# EAGLE design schematic (EAGLE 6.4)
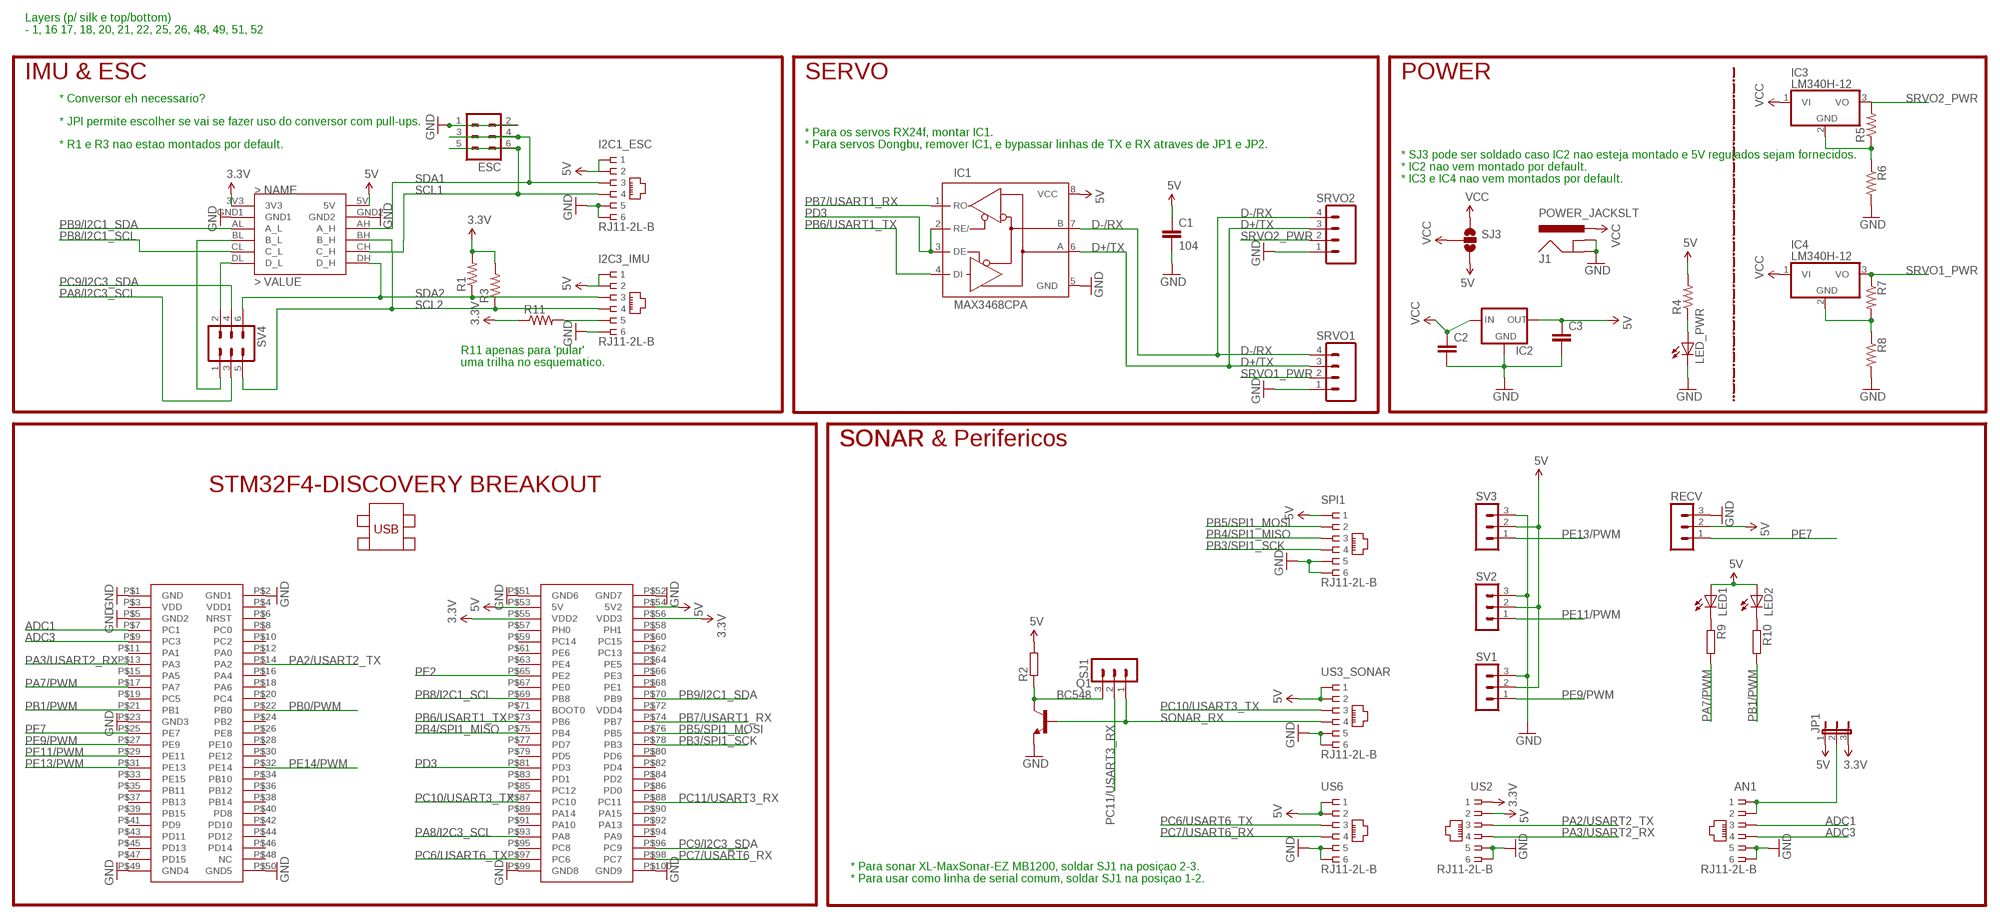
[diagram p0: schematic, sheet 1]

## Parts
AN1  RJ11-2L-B  [RJ11-NO_SHIELD]
C1  104  0.1UF-50V-20%(PTH)KIT-EZ  [CAP-PTH-SMALL-KIT]
C2  C7.5/3  [C7.5B3]
C3  0.1UF-50V-20%(PTH)KIT-EZ  [CAP-PTH-SMALL-KIT]
ESC  MA03-2  [MA03-2]
I2C1_ESC  RJ11-2L-B  [RJ11-NO_SHIELD]
I2C3_IMU  RJ11-2L-B  [RJ11-NO_SHIELD]
IC1  MAX3468CPA  [DIL08]
IC2  V_REG_78XX-TO-220  [TO-220-ALT]
IC3  LM340H-12  [TO220H]
IC4  LM340H-12  [TO220H]
J1  POWER_JACKSLT  [POWER_JACK_SLOT]
JP1  JP2E  [JP2]
LED1  LED3MM  [LED3MM]
LED2  LED3MM  [LED3MM]
LED_PWR  LED5MM  [LED5MM]
Q1  BC548  [TO92-EBC]
R1  R-US_0204/5  [0204/5]
R2  R-EU_0204/7  [0204/7]
R3  R-US_0204/5  [0204/5]
R4  R-US_0204/7  [0204/7]
R5  R-US_0204/7  [0204/7]
R6  R-US_0204/7  [0204/7]
R7  R-US_0204/7  [0204/7]
R8  R-US_0204/7  [0204/7]
R9  R-EU_0204/2V  [0204V]
R10  R-EU_0204/2V  [0204V]
R11  R-US_M1406  [M1406]
RECV  MA03-1  [MA03-1]
SJ1  MA03-1  [MA03-1]
SJ3  SOLDERJUMPER_2WAY-OLDW  [SJ_2W]
SPI1  RJ11-2L-B  [RJ11-NO_SHIELD]
SRVO1  M04POLAR  [MOLEX-1X4]
SRVO2  M04POLAR  [MOLEX-1X4]
SV1  MA03-1  [MA03-1]
SV2  MA03-1  [MA03-1]
SV3  MA03-1  [MA03-1]
SV4  MA03-2  [MA03-2]
U$1  STM32F4-DISCOVERY  [STM32F4-DISCOVERY]
U$2  JYMCU_LOGIC_LEVEL_CONVERTER  [JYMCU_LOGIC_LEVEL_SHIFTER_DIP]
US2  RJ11-2L-B  [RJ11-NO_SHIELD]
US3_SONAR  RJ11-2L-B  [RJ11-NO_SHIELD]
US6  RJ11-2L-B  [RJ11-NO_SHIELD]

## Nets
3.3V: JP1.3 R1.2 R3.2 R11.1 U$1.P$55(VDD2) U$1.P$56(VDD3) U$2.3V3 US2.1
5V: C1.1 C3.1 I2C1_ESC.1 I2C1_ESC.2 I2C3_IMU.1 I2C3_IMU.2 IC1.8(VCC) IC2.OUT JP1.1 LED1.A LED2.A R2.2 R4.2 RECV.2 SJ3.3 SPI1.1 SV1.2 SV2.2 SV3.2 U$1.P$53(5V) U$1.P$54(5V2) U$2.5V US2.2 US3_SONAR.1 US3_SONAR.2 US6.1 US6.2
ADC1: AN1.3 U$1.P$7(PC1)
ADC3: AN1.4 U$1.P$9(PC3)
D+/TX: IC1.6(A) SRVO1.3 SRVO2.3
D-/RX: IC1.7(B) SRVO1.4 SRVO2.4
GND: AN1.5 AN1.6 C1.2 C2.2 C3.2 ESC.1 ESC.2 I2C1_ESC.5 I2C1_ESC.6 I2C3_IMU.6 IC1.5(GND) IC2.GND J1.GND@1(GNDBREAK) J1.GND@2(GND) LED_PWR.K(C) Q1.E R6.2 R8.2 RECV.3 SPI1.5 SPI1.6 SRVO1.1 SRVO2.1 SV1.3 SV2.3 SV3.3 U$1.P$1(GND) U$1.P$2(GND1) U$1.P$5(GND2) U$1.P$23(GND3) U$1.P$49(GND4) U$1.P$50(GND5) U$1.P$51(GND6) U$1.P$52(GND7) U$1.P$99(GND8) U$1.P$100(GND9) U$2.GND1 U$2.GND2 US2.5 US2.6 US3_SONAR.5 US3_SONAR.6 US6.5 US6.6
N$1: SV4.2 U$2.DL(D_L)
N$2: SV4.1 U$2.BL(B_L)
N$3: Q1.C R2.1 SJ1.3
N$4: LED_PWR.A R4.1
N$5: LED1.K(C) R9.1
N$6: IC3.2(GND) R5.1 R6.1
N$7: LED2.K(C) R10.1
N$8: IC4.2(GND) R7.2 R8.1
N$9: I2C3_IMU.5 R11.2
N$10: AN1.1 AN1.2 JP1.2
PA2/USART2_TX: U$1.P$14(PA2) US2.3
PA3/USART2_RX: U$1.P$13(PA3) US2.4
PA7/PWM: R9.2 U$1.P$17(PA7)
PA8/I2C3_SCL: SV4.3 U$1.P$93(PA8)
PB0/PWM: U$1.P$22(PB0)
PB1/PWM: R10.2 U$1.P$21(PB1)
PB3/SPI1_SCK: SPI1.4 U$1.P$78(PB3)
PB4/SPI1_MISO: SPI1.3 U$1.P$75(PB4)
PB5/SPI1_MOSI: SPI1.2 U$1.P$76(PB5)
PB6/USART1_TX: IC1.4(DI) U$1.P$73(PB6)
PB7/USART1_RX: IC1.1(RO) U$1.P$74(PB7)
PB8/I2C1_SCL: U$1.P$69(PB8) U$2.CL(C_L)
PB9/I2C1_SDA: U$1.P$70(PB9) U$2.AL(A_L)
PC6/USART6_TX: U$1.P$97(PC6) US6.3
PC7/USART6_RX: U$1.P$98(PC7) US6.4
PC9/I2C3_SDA: SV4.4 U$1.P$96(PC9)
PC10/USART3_TX: U$1.P$87(PC10) US3_SONAR.3
PC11/USART3_RX: SJ1.2 U$1.P$88(PC11)
PD3: IC1.2(RE/) IC1.3(DE) U$1.P$81(PD3)
PE2: U$1.P$65(PE2)
PE7: RECV.1 U$1.P$25(PE7)
PE9/PWM: SV1.1 U$1.P$27(PE9)
PE11/PWM: SV2.1 U$1.P$29(PE11)
PE13/PWM: SV3.1 U$1.P$31(PE13)
PE14/PWM: U$1.P$32(PE14)
SCL1: ESC.5 ESC.6 I2C1_ESC.4 U$2.CH(C_H)
SCL2: I2C3_IMU.4 R3.1 SV4.5 U$2.BH(B_H)
SDA1: ESC.3 ESC.4 I2C1_ESC.3 U$2.AH(A_H)
SDA2: I2C3_IMU.3 R1.1 SV4.6 U$2.DH(D_H)
SONAR_RX: Q1.B SJ1.1 US3_SONAR.4
SRVO1_PWR: IC4.3(VO) R7.1 SRVO1.2
SRVO2_PWR: IC3.3(VO) R5.2 SRVO2.2
VCC: C2.1 IC2.IN IC3.1(VI) IC4.1(VI) J1.PWR SJ3.1 SJ3.2
Unconnected: U$1.P$3(VDD) U$1.P$4(VDD1) U$1.P$6(NRST) U$1.P$8(PC0) U$1.P$10(PC2) U$1.P$11(PA1) U$1.P$12(PA0) U$1.P$15(PA5) U$1.P$16(PA4) U$1.P$18(PA6) U$1.P$19(PC5) U$1.P$20(PC4) U$1.P$24(PB2) U$1.P$26(PE8) U$1.P$28(PE10) U$1.P$30(PE12) U$1.P$33(PE15) U$1.P$34(PB10) U$1.P$35(PB11) U$1.P$36(PB12) U$1.P$37(PB13) U$1.P$38(PB14) U$1.P$39(PB15) U$1.P$40(PD8) U$1.P$41(PD9) U$1.P$42(PD10) U$1.P$43(PD11) U$1.P$44(PD12) U$1.P$45(PD13) U$1.P$46(PD14) U$1.P$47(PD15) U$1.P$48(NC) U$1.P$57(PH0) U$1.P$58(PH1) U$1.P$59(PC14) U$1.P$60(PC15) U$1.P$61(PE6) U$1.P$62(PC13) U$1.P$63(PE4) U$1.P$64(PE5) U$1.P$66(PE3) U$1.P$67(PE0) U$1.P$68(PE1) U$1.P$71(BOOT0) U$1.P$72(VDD4) U$1.P$77(PD7) U$1.P$79(PD5) U$1.P$80(PD6) U$1.P$82(PD4) U$1.P$83(PD1) U$1.P$84(PD2) U$1.P$85(PC12) U$1.P$86(PD0) U$1.P$89(PA14) U$1.P$90(PA15) U$1.P$91(PA10) U$1.P$92(PA13) U$1.P$94(PA9) U$1.P$95(PC8)

## Notes on the sheet
- Layers (p/ silk e top/bottom)
  - 1, 16 17, 18, 20, 21, 22, 25, 26, 48, 49, 51, 52
- IMU & ESC | SERVO | POWER
- * Conversor eh necessario?
- * JPI permite escolher se vai se fazer uso do conversor com pull-ups.
- * R1 e R3 nao estao montados por default.
- * Para os servos RX24f, montar IC1. 
  * Para servos Dongbu, remover IC1, e bypassar linhas de TX e RX atraves de JP1 e JP2.
- * SJ3 pode ser soldado caso IC2 nao esteja montado e 5V regulados sejam fornecidos.
  * IC2 nao vem montado por default.
  * IC3 e IC4 nao vem montados por default.
- R11 apenas para 'pular' 
  uma trilha no esquematico.
- SONAR | SONAR | SONAR & Perifericos
- * Para sonar XL-MaxSonar-EZ MB1200, soldar SJ1 na posiçao 2-3.
  * Para usar como linha de serial comum, soldar SJ1 na posiçao 1-2.

## Library data of the parts
AN1 I2C1_ESC I2C3_IMU SPI1 US2 US3_SONAR US6 = con-tycoelectronics:RJ11: CORCOM Modular RJ Jacks No Shield Source: www.tycoelectronics.com .. ENG_DS_1654001_1099_RJ_L_0507.pdf; MF: TYCO ELECTRONICS; MPN: RJ11-2L-B; OC_FARNELL: unknown; OC_NEWARK: 83F4463
C1 C3 = SparkFun-Capacitors:0.1UF-50V-20%(PTH): CAP-08370; PROD_ID: CAP-08370
C2 = capacitor-wima:C: CAPACITOR naming: grid - package width
ESC SV4 = con-lstb:MA03-2: PIN HEADER; OC_FARNELL: unknown; OC_NEWARK: unknown
IC1 = maxim:MAX34*: +5V, Fail-Safe, 40Mbps, Profibus RS-485/RS-422 Transceivers Source: MAX3465-MAX3469.pdf; OC_FARNELL: unknown; OC_NEWARK: unknown
IC2 = SparkFun-PowerIC:V_REG_78XX: Voltage Regulator Standard 7805 5V regulator. IGO (Input Ground Output). Spark Fun Electronics SKU : COM-00107
IC3 IC4 = linear:LM340?-*: Positive VOLTAGE REGULATOR Source: http://cache.national.com/ds/LM/LM340.pdf
J1 = SparkFun-Connectors:POWER_JACK: Power Jack This is the standard 5.5mm barrel jack for power. The PTH is the most common, proven, reliable, footprint. The Slot footprint only works if the mill layer is transmitted to the PCB fab house so be warned. Spark Fun Electronics SKU : PRT-00119 SMT: CONN-08106 Mating wall wart : TOL-00298 (and others)
JP1 = jumper:JP2E: JUMPER
LED1 LED2 LED_PWR = adafruit:LED: LED OSRAM: - CHIPLED LG R971, LG N971, LY N971, LG Q971, LY Q971, LO R971, LY R971 LH N974, LH R974 LS Q976, LO Q976, LY Q976 LO Q996 - Hyper CHIPLED LW Q18S LB Q993, LB Q99A, LB R99A - SideLED LS A670, LO A670, LY A670, LG A670, LP A670 LB A673, LV A673, LT A673, LW A673 LH A674 LY A675 LS A676, LA A676, LO A676, LY A676, LW A676 LS A679, LY A679, LG A679 - Hyper Micro SIDELED® LS Y876, LA Y876, LO Y876, LY Y876 LT Y87S - SmartLED LW L88C, LW L88S LB L89C, LB L89S, LG L890 LS L89K, LO L89K, LY L89K LS L896, LA L896, LO L896, LY L896 - TOPLED LS T670, LO T670, LY T670, LG T670, LP T670 LSG T670, LSP T670, LSY T670, LOP T670, LYG T670 LG T671, LOG T671, LSG T671 LB T673, LV T673, LT T673, LW T673 LH T674 LS T676, LA T676, LO T676, LY T676, LB T676, LH T676, LSB T676, LW T676 LB T67C, LV T67C, LT T67C, LS T67K, LO T67K, LY T67K, LW E67C LS E67B, LA E67B, LO E67B, LY E67B, LB E67C, LV E67C, LT E67C LW T67C LS T679, LY T679, LG T679 LS T770, LO T770, LY T770, LG T770, LP T770 LB T773, LV T773, LT T773, LW T773 LH T774 LS E675, LA E675, LY E675, LS T675 LS T776, LA T776, LO T776, LY T776, LB T776 LHGB T686 LT T68C, LB T68C - Hyper Mini TOPLED® LB M676 - Mini TOPLED Santana® LG M470 LS M47K, LO M47K, LY M47K Source: http://www.osram.convergy.de/
Q1 = transistor-npn:BC548*: NPN Transistor
R1 R3-R8 R11 = adafruit:R-US_: RESISTOR, American symbol
R2 R9 R10 = rcl:R-EU_: RESISTOR, European symbol
RECV SJ1 SV1-SV3 = con-lstb:MA03-1: PIN HEADER; OC_FARNELL: unknown; OC_NEWARK: unknown
SJ3 = SparkFun-Passives:SOLDERJUMPER_2WAY-OLD: Solder Jumper 2 way solder jumper
SRVO1 SRVO2 = SparkFun-Connectors:M04: Header 4 Standard 4-pin 0.1" header. Use with straight break away headers (SKU : PRT-00116), right angle break away headers (PRT-00553), swiss pins (PRT-00743), machine pins (PRT-00117), and female headers (PRT-00115). Molex polarized connector foot print use with SKU : PRT-08231 with associated crimp pins and housings. 1MM SMD Version SKU: PRT-10208
U$1 = STM32F4-DISCOVERY:STM32F4-DISCOVERY
U$2 = provant_custom:JYMCU_LOGIC_LEVEL_CONVERTER

## Board
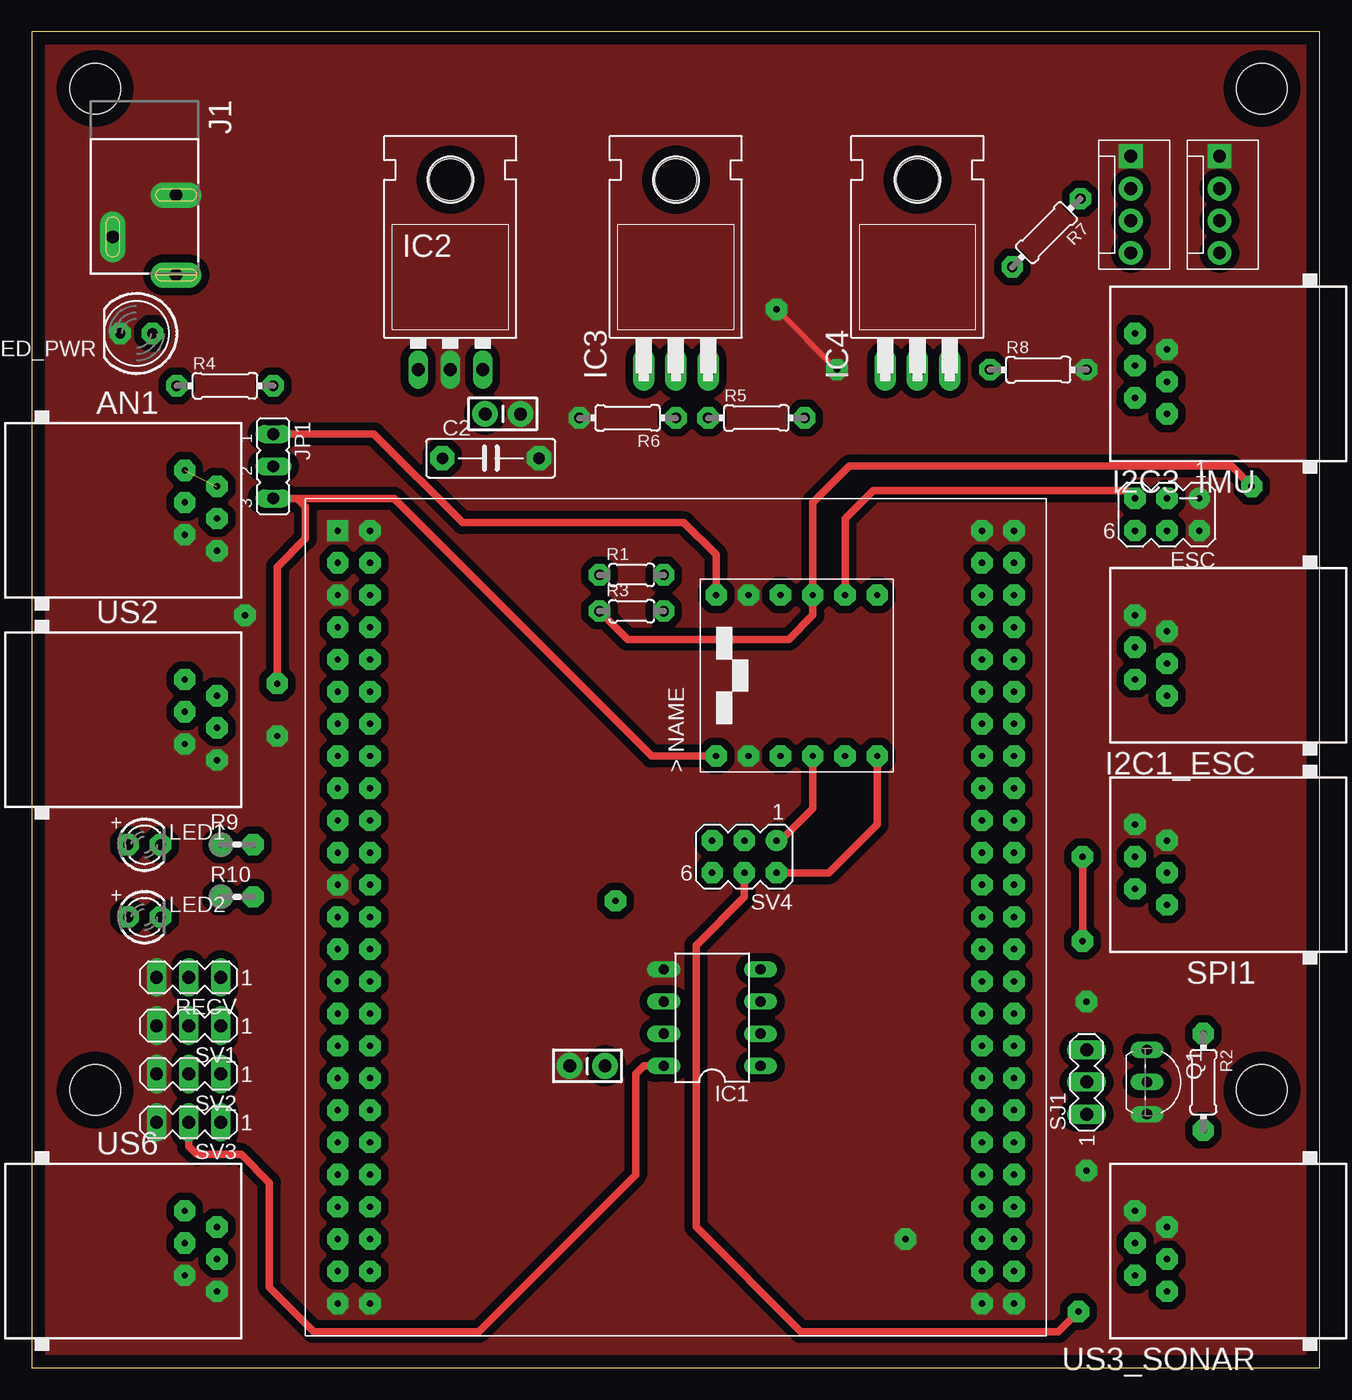
[diagram p1: board, top side]
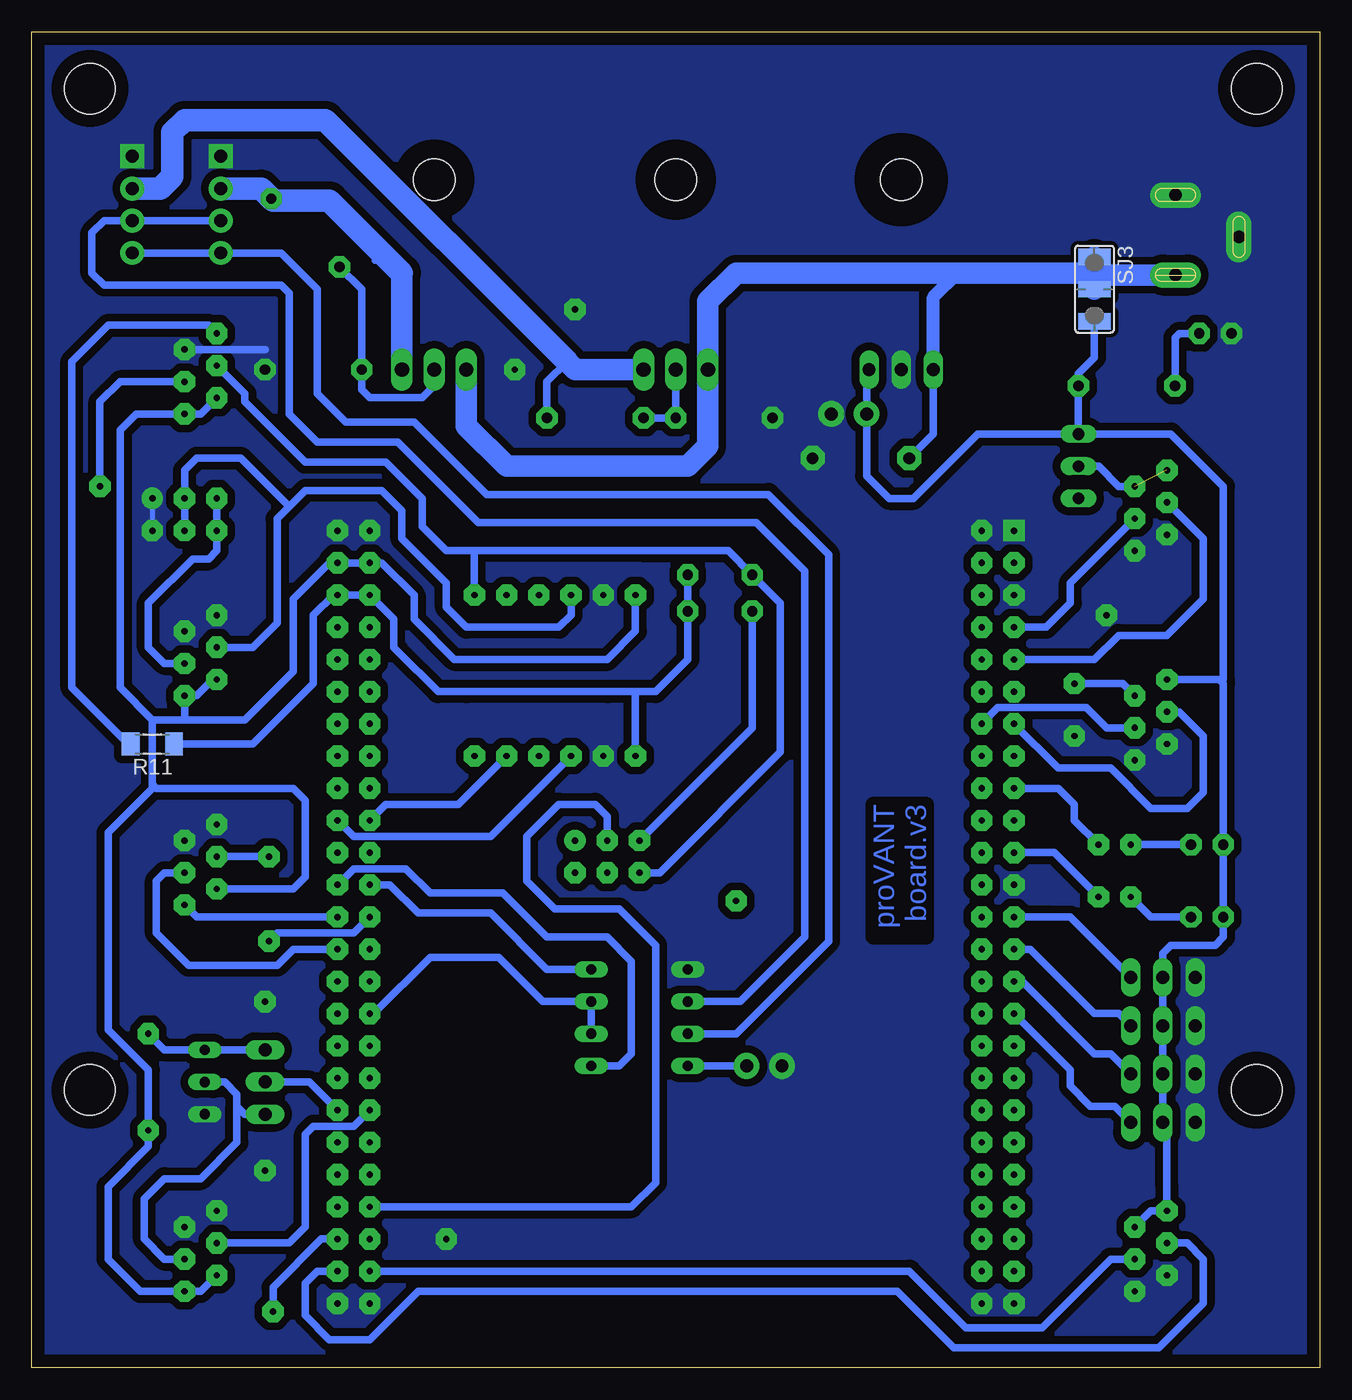
[diagram p2: board, bottom side, seen from below]

Size 101.59 x 105.4 mm. Coordinates in mm from the lower left corner, seen from the top.
Outline: 0,0 101.59,0 101.59,105.4 0,105.4 0,0
Copper layers (1*16): Top 0.035mm / dielectric 1.5mm / Bottom 0.035mm
Design rules "default": minimum track width 10mil, minimum drill 24mil, track to track 8mil, track to pad 8mil, pad to pad 8mil, via to via 8mil, smd to smd 8mil, copper to edge 40mil, drill to drill 8mil, minimum pad ring 10mil, minimum via ring 8mil, stop-mask expansion 4mil, vias tented up to drill 0mil, thermal gap 10mil
Holes 4 mm at 5,100.92 5,21.92 97,100.92 97,21.92

### Footprints (pad centres in the part's own frame; a part is rotated, then mirrored left to right if it is on the bottom)
RJ11-NO_SHIELD = drill 0.5 pad 1.676 octagon: 1 -1.905,8.89; 2 -3.175,6.35; 3 0.635,8.89; 4 -0.635,6.35; 5 3.175,8.89; 6 1.905,6.35
CAP-PTH-SMALL-KIT = drill 1.016 pad 2.032: 1 -1.397,0; 2 1.397,0
C7.5B3 = drill 0.914 pad 1.905 octagon: 1 -3.81,0; 2 3.81,0
MA03-2 = drill 0.5 pad 1.676: 1 -2.54,-1.27 | drill 0.5 pad 1.676 octagon: 2 -2.54,1.27; 3 0,-1.27; 4 0,1.27; 5 2.54,-1.27; 6 2.54,1.27
DIL08 = drill 0.813 long: 1 -3.81,-3.81; 2 -1.27,-3.81; 3 1.27,-3.81; 4 3.81,-3.81; 5 3.81,3.81; 6 1.27,3.81; 7 -1.27,3.81; 8 -3.81,3.81
TO-220-ALT = drill 1.016 long: GND 0,-3.81; IN -2.54,-3.81; OUT 2.54,-3.81 | hole 3.302: 0,11.176
TO220H = drill 1.118 long: 1 -2.54,-10.16; 2 0,-10.16; 3 2.54,-10.16 | hole 3.302: 0,4.826
POWER_JACK_SLOT = drill 1 pad 2 long: GND@1 2.58,7.5; GND@2 7.58,10.8; PWR 2.58,13.8
JP2 = drill 0.914 long: 1 -2.54,0; 2 0,0; 3 2.54,0
LED3MM = drill 0.813 pad 1.676 octagon: A -1.27,0; K 1.27,0
LED5MM = drill 0.813 pad 1.676 octagon: A -1.27,0; K 1.27,0
TO92-EBC = drill 0.813 long: B 0,-1.27; C -2.54,-1.27; E 2.54,-1.27
0204/5 = drill 0.813 pad 1.676 octagon: 1 -2.54,0; 2 2.54,0
0204/7 = drill 0.5 pad 1.676 octagon: 1 -3.81,0; 2 3.81,0
0204/7' = drill 0.813 pad 1.676 octagon: 1 -3.81,0; 2 3.81,0
0204V = drill 0.5 pad 1.676 octagon: 1 -1.27,0; 2 1.27,0
M1406 = smd 1.4 x 1.8: 1 -1.7,0; 2 1.7,0
MA03-1 = drill 1.016 long: 1 -2.54,0; 2 0,0; 3 2.54,0
SJ_2W = smd 1.27 x 2.54: 1 -2.54,0; 2 0,0; 3 2.54,0
MOLEX-1X4 = drill 1.016 pad 1.88 square: 1 0,0 | drill 1.016 pad 1.88: 2 2.54,0; 3 5.08,0; 4 7.62,0
STM32F4-DISCOVERY = drill 0.5 pad 1.676 square: P$1 -27.94,30.48 | drill 0.5 pad 1.676 octagon: P$2 -25.4,30.48; P$3 -27.94,27.94; P$4 -25.4,27.94; P$5 -27.94,25.4; P$6 -25.4,25.4; P$7 -27.94,22.86; P$8 -25.4,22.86; P$9 -27.94,20.32; P$10 -25.4,20.32; P$11 -27.94,17.78; P$12 -25.4,17.78; P$13 -27.94,15.24; P$14 -25.4,15.24; P$15 -27.94,12.7; P$16 -25.4,12.7; P$17 -27.94,10.16; P$18 -25.4,10.16; P$19 -27.94,7.62; P$20 -25.4,7.62; P$21 -27.94,5.08; P$22 -25.4,5.08; P$23 -27.94,2.54; P$24 -25.4,2.54; P$25 -27.94,0; P$26 -25.4,0; P$27 -27.94,-2.54; P$28 -25.4,-2.54; P$29 -27.94,-5.08; P$30 -25.4,-5.08; P$31 -27.94,-7.62; P$32 -25.4,-7.62; P$33 -27.94,-10.16; P$34 -25.4,-10.16; P$35 -27.94,-12.7; P$36 -25.4,-12.7; P$37 -27.94,-15.24; P$38 -25.4,-15.24; P$39 -27.94,-17.78; P$40 -25.4,-17.78; P$41 -27.94,-20.32; P$42 -25.4,-20.32; P$43 -27.94,-22.86; P$44 -25.4,-22.86; P$45 -27.94,-25.4; P$46 -25.4,-25.4; P$47 -27.94,-27.94; P$48 -25.4,-27.94; P$49 -27.94,-30.48; P$50 -25.4,-30.48; P$51 22.86,30.48; P$52 25.4,30.48; P$53 22.86,27.94; P$54 25.4,27.94; P$55 22.86,25.4; P$56 25.4,25.4; P$57 22.86,22.86; P$58 25.4,22.86; P$59 22.86,20.32; P$60 25.4,20.32; P$61 22.86,17.78; P$62 25.4,17.78; P$63 22.86,15.24; P$64 25.4,15.24; P$65 22.86,12.7; P$66 25.4,12.7; P$67 22.86,10.16; P$68 25.4,10.16; P$69 22.86,7.62; P$70 25.4,7.62; P$71 22.86,5.08; P$72 25.4,5.08; P$73 22.86,2.54; P$74 25.4,2.54; P$75 22.86,0; P$76 25.4,0; P$77 22.86,-2.54; P$78 25.4,-2.54; P$79 22.86,-5.08; P$80 25.4,-5.08; P$81 22.86,-7.62; P$82 25.4,-7.62; P$83 22.86,-10.16; P$84 25.4,-10.16; P$85 22.86,-12.7; P$86 25.4,-12.7; P$87 22.86,-15.24; P$88 25.4,-15.24; P$89 22.86,-17.78; P$90 25.4,-17.78; P$91 22.86,-20.32; P$92 25.4,-20.32; P$93 22.86,-22.86; P$94 25.4,-22.86; P$95 22.86,-25.4; P$96 25.4,-25.4; P$97 22.86,-27.94; P$98 25.4,-27.94; P$99 22.86,-30.48; P$100 25.4,-30.48
JYMCU_LOGIC_LEVEL_SHIFTER_DIP = drill 0.5 pad 1.676 octagon: 3V3 -6.35,6.35; 5V 6.35,6.35; AH 6.35,1.27; AL -6.35,1.27; BH 6.35,-1.27; BL -6.35,-1.27; CH 6.35,-3.81; CL -6.35,-3.81; DH 6.35,-6.35; DL -6.35,-6.35; GND1 -6.35,3.81; GND2 6.35,3.81

### Placement (x,y rotation side)
AN1  5.71,67.63 270 top
C1  43.81,23.81 180 top
C2  36.2,71.75 0 top
C3  37.15,75.25 0 top
ESC  89.53,67.31 180 top
I2C1_ESC  95.89,56.2 90 top
I2C3_IMU  95.89,78.42 90 top
IC1  53.66,27.62 90 top
IC2  33.02,82.55 0 top
IC3  50.8,88.9 0 top
IC4  69.85,88.9 0 top
J1  13.97,100.01 180 top
JP1  19.05,71.12 270 top
LED1  8.89,41.27 0 top
LED2  8.89,35.56 0 top
LED_PWR  8.26,81.6 180 top
Q1  89.22,22.54 270 top
R1  47.31,62.55 0 top
R2  92.39,22.54 270 top
R3  47.31,59.69 0 top
R4  [0204/7']  15.24,77.47 0 top
R5  [0204/7']  57.15,74.93 0 top
R6  [0204/7']  46.99,74.93 180 top
R7  [0204/7']  80.01,89.53 225 top
R8  [0204/7']  79.38,78.74 0 top
R9  16.19,41.27 0 top
R10  16.19,37.15 0 top
R11  92.08,49.21 180 bottom
RECV  12.38,30.8 180 top
SJ1  83.19,22.54 90 top
SJ3  17.78,85.09 270 bottom
SPI1  95.89,39.69 90 top
SRVO1  86.68,95.57 270 top
SRVO2  93.66,95.57 270 top
SV1  12.38,26.99 180 top
SV2  12.38,23.18 180 top
SV3  12.38,19.37 180 top
SV4  56.2,40.32 180 top
U$1  52.07,35.56 0 top
U$2  60.33,54.61 90 top
US2  5.71,51.12 270 top
US3_SONAR  95.89,9.21 90 top
US6  5.71,9.21 270 top

### Tracks (layer width: path | path; a pad name or v marks a point on that pad's centre or on a via)
3.3V  (via drill 0.5 pad 1.68)
  Top 0.61: v19.37,53.98 19.37,63.18 21.59,65.41 21.59,67.95 20.95,68.58 JP1.3 28.57,68.58 48.9,48.26 U$2.3V3
  Bottom 0.406: U$1.P$56 77.79,60.96
  Bottom 0.61: U$1.P$56 U$1.P$55 73.03,59.06 73.03,56.83 72.71,56.52 69.53,53.34 67.31,53.34 56.2,53.34 53.98,53.34 | 77.79,60.96 79.38,59.37 79.38,53.98 84.14,49.21 R11.1 | 19.05,54.29 v19.37,53.98 15.56,53.98 US2.1 | 53.98,53.34 52.39,53.34 49.85,55.88 R3.2 R1.2 | U$2.3V3 53.98,53.34
5V
  Top 0.61: IC1.8 48.26,23.81 47.62,23.18 47.62,15.24 35.24,2.86 22.23,2.86 18.73,6.35 18.73,14.6 16.51,16.83 15.56,16.83 13.02,16.83 12.38,17.46 SV3.2 | U$2.5V 53.98,64.14 51.44,66.67 33.97,66.67 26.99,73.66 JP1.1
  Bottom 0.61: SJ3.3 17.78,79.69 19.05,78.42 R4.2 JP1.1 | C1.1 IC1.8 | 89.53,51.12 84.77,51.12 80.96,54.93 80.96,60.64 78.11,63.5 U$1.P$54 U$1.P$53 73.98,63.5 71.44,60.96 71.44,59.06 68.26,55.88 56.2,55.88 53.98,58.1 U$2.5V | 89.53,51.12 92.08,51.12 | 89.53,51.12 I2C1_ESC.2 88.58,53.02 87.31,54.29 I2C1_ESC.1 | 92.08,51.12 92.08,46.04 | 92.08,46.04 92.08,45.72 95.57,42.23 95.57,26.67 92.39,23.49 R2.2 92.39,17.46 95.57,14.29 95.57,8.57 93.03,6.03 US3_SONAR.2 88.27,6.03 US3_SONAR.1 | 92.08,51.12 94.61,53.66 94.61,73.98 93.34,75.25 I2C3_IMU.2 88.27,75.25 I2C3_IMU.1 | JP1.1 11.75,73.66 7.62,69.53 7.62,54.29 7.94,54.29 | 92.08,46.04 91.76,45.72 80.96,45.72 80.01,44.77 80.01,38.73 80.96,37.78 SPI1.1 | US2.2 7.94,54.29 | 7.94,54.29 7.62,53.98 LED1.A LED2.A 7.62,33.97 8.26,33.34 11.75,33.34 12.38,32.7 RECV.2 SV1.2 SV2.2 SV3.2 12.06,19.05 12.06,14.29 US6.2 13.34,12.38 US6.1 | JP1.1 26.99,73.66 32.07,68.58 33.97,68.58 35.75,70.36 C3.1 35.75,78.55 IC2.OUT
ADC1
  Bottom 0.61: U$1.P$7 21.59,58.42 19.68,60.33 19.68,61.91 AN1.3
ADC3
  Bottom 0.61: U$1.P$9 17.78,55.88 15.88,57.79 12.06,57.79 9.21,60.64 9.21,65.41 10.79,66.99 AN1.4
D+/TX
  Bottom 0.61: IC1.6 45.72,28.89 40.64,33.97 40.64,62.86 44.45,66.67 66.36,66.67 72.71,73.03 79.06,73.03 81.28,75.25 81.28,84.77 81.92,85.41 95.89,85.41 96.84,86.36 96.84,89.53 95.89,90.49 SRVO2.3 SRVO1.3
D-/RX
  Bottom 0.61: IC1.7 46.04,26.35 38.73,33.66 38.73,64.14 43.5,68.9 65.72,68.9 71.44,74.61 76.83,74.61 79.06,76.84 79.06,85.09 81.92,87.95 SRVO1.4 SRVO2.4
GND  (via drill 0.5 pad 1.68)
  Top 0.406: v63.5,78.74 v58.74,83.5
  Bottom 0.406: ESC.1 ESC.2
  Bottom 0.61: I2C3_IMU.6 83.19,80.33
  other vias: 83.19,28.89 83.19,15.56 19.37,49.85 68.9,10.16 16.83,59.37
  pour Bottom (isolate 0.61, no thermals): -8.89,105.41 -8.89,-5.08 111.44,-5.08 111.44,105.41
  pour Top (isolate 0.61, no thermals): 0,105.41 101.6,105.41 101.6,0 0,0
N$1
  Top 0.61: SV4.2 62.87,39.05 66.67,42.86 U$2.DL
N$2
  Top 0.61: SV4.1 59.05,41.59 61.59,44.13 U$2.BL
N$3
  Bottom 0.61: SJ1.3 Q1.C 91.12,25.08 R2.1
N$4
  Bottom 0.61: R4.1 11.43,81.28 11.11,81.6 LED_PWR.A
N$5
  Bottom 0.61: LED1.K R9.1
N$6
  Bottom 0.61: IC3.2 R6.1 R5.1
N$7
  Bottom 0.61: LED2.K 13.34,35.56 R10.1
N$8
  Bottom 0.406: 69.85,77.47 IC4.2
  Bottom 0.61: 69.85,77.47 70.8,76.52 74.93,76.52 75.56,77.15 R8.1 75.56,85.09 R7.2
N$9
  Bottom 0.61: R11.2 93.98,49.21 98.42,53.66 98.42,79.38 95.57,82.23 87.63,82.23 I2C3_IMU.5
N$10  (1 unrouted)
  Bottom 0.61: JP1.2 17.46,71.12 15.88,69.53 AN1.1
N$11  (via drill 0.5 pad 1.68)
  other vias: 46.04,36.83
PA2/USART2_TX
  Bottom 0.61: U$1.P$14 25.4,52.07 18.41,52.07 16.83,50.48 US2.3
PA3/USART2_RX
  Bottom 0.61: U$1.P$13 20.64,47.31 16.51,47.31 13.34,44.13 10.48,44.13 9.21,45.4 9.21,49.85 11.11,51.75 US2.4
PA7/PWM
  Bottom 0.61: U$1.P$17 20.64,45.72 19.37,44.45 19.37,43.18 R9.2
PA8/I2C3_SCL
  Bottom 0.61: U$1.P$93 54.29,12.7 52.39,14.6 52.39,33.34 55.24,36.2 60.33,36.2 62.55,38.42 62.55,41.91 60.01,44.45 57.15,44.45 56.2,43.5 SV4.3
PB1/PWM
  Bottom 0.61: U$1.P$21 21.59,40.64 20.95,40.64 R10.2
PB3/SPI1_SCK
  Bottom 0.61: U$1.P$78 80.96,33.02 82.23,31.75 89.22,31.75 91.76,34.29 91.76,38.42 91.12,39.05 SPI1.4
PB4/SPI1_MISO  (via drill 0.5 pad 1.68)
  Top 0.61: v82.87,33.66 v82.87,40.32
  Bottom 0.61: U$1.P$75 76.2,34.29 82.23,34.29 v82.87,33.66 | v82.87,40.32 SPI1.3
PB5/SPI1_MOSI
  Bottom 0.61: U$1.P$76 81.6,35.56 88.58,35.56 SPI1.2
PB6/USART1_TX
  Bottom 0.61: IC1.4 59.69,31.43 60.96,31.43 65.41,35.88 71.12,35.88 73.34,38.1 U$1.P$73
PB7/USART1_RX
  Bottom 0.61: U$1.P$74 76.2,39.37 72.07,39.37 70.17,37.47 64.45,37.47 61.28,34.29 60.96,33.97 56.2,33.97 54.29,32.07 54.29,24.77 55.24,23.81 IC1.1
PB8/I2C1_SCL
  Bottom 0.61: U$1.P$69 73.66,44.45 68.26,44.45 67.94,44.45 U$2.CL
PB9/I2C1_SDA
  Bottom 0.61: U$1.P$70 76.2,41.91 65.72,41.91 65.41,41.91 U$2.AL
PC6/USART6_TX
  Bottom 0.61: U$1.P$97 32.38,7.62 27.94,3.18 21.91,3.18 16.51,8.57 US6.3
PC7/USART6_RX
  Bottom 0.61: U$1.P$98 79.06,7.62 80.01,6.67 80.01,4.13 78.11,2.22 74.93,2.22 71.12,6.03 33.34,6.03 28.89,1.59 12.7,1.59 9.21,5.08 9.21,8.57 10.48,9.84 US6.4
PC9/I2C3_SDA  (via drill 0.5 pad 1.68)
  Top 0.61: SV4.4 56.2,37.15 52.39,33.34 52.39,11.11 60.64,2.86 80.96,2.86 v82.55,4.45
  Bottom 0.61: U$1.P$96 78.74,10.16 82.55,6.35 v82.55,4.45
PC10/USART3_TX
  Bottom 0.61: U$1.P$87 76.2,19.05 79.38,19.05 80.01,18.41 80.01,11.11 81.28,9.84 US3_SONAR.3
PC11/USART3_RX
  Bottom 0.61: U$1.P$88 79.69,22.54 SJ1.2
PD3
  Bottom 0.406: U$1.P$81 74.61,27.94
  Bottom 0.61: IC1.2 IC1.3 61.28,28.89 64.77,32.39 70.17,32.39 74.61,27.94
PE7
  Bottom 0.61: U$1.P$25 21.27,35.56 19.68,35.56 RECV.1
PE9/PWM
  Bottom 0.61: U$1.P$27 23.18,33.02 22.86,33.02 17.78,27.94 15.88,27.94 SV1.1
PE11/PWM
  Bottom 0.61: U$1.P$29 23.81,30.48 23.5,30.48 17.78,24.77 16.51,24.77 SV2.1
PE13/PWM
  Bottom 0.61: U$1.P$31 19.68,23.49 19.68,22.54 19.68,22.23 18.1,20.64 16.19,20.64 SV3.1
SCL1
  Top 0.61: ESC.5 86.36,69.22 68.58,69.22 66.36,69.22 64.14,66.99 U$2.CH
  Bottom 0.61: ESC.5 ESC.6 87,64.45 87.63,63.82 88.9,63.82 92.39,60.33 92.39,56.83 91.12,55.56 I2C1_ESC.4
SCL2  (via drill 0.5 pad 1.68)
  Top 0.61: R3.1 46.99,57.47 59.69,57.47 61.59,59.37 U$2.BH 61.59,68.26 64.45,71.12 94.61,71.12 v96.2,69.53
  Bottom 0.61: R3.1 44.77,50.48 SV4.5 | v96.2,69.53 96.2,76.2 94.61,77.79 I2C3_IMU.4
SDA1
  Bottom 0.61: ESC.3 ESC.4 89.53,70.8 88.58,71.75 85.09,71.75 81.28,67.95 | 81.28,67.95 80.01,69.22 73.98,69.22 72.39,67.63 72.39,65.41 69.53,62.55 68.9,61.91 68.9,60.01 67.31,58.42 60.01,58.42 59.05,59.37 U$2.AH | 81.28,67.95 82.23,66.99 82.23,58.74 84.14,56.83 I2C1_ESC.3
SDA2
  Bottom 0.61: I2C3_IMU.3 85.72,77.79 84.77,76.84 84.77,76.2 80.01,71.44 73.66,71.44 70.8,68.58 70.8,66.36 69.22,64.77 68.9,64.45 66.67,64.45 | 66.67,64.45 53.34,64.45 46.67,64.45 R1.1 42.55,60.33 42.55,48.58 52.07,39.05 SV4.6 | U$2.DH 66.67,64.45
SONAR_RX
  Bottom 0.61: Q1.B 86.36,22.54 85.41,21.59 85.41,20.64 | 85.41,20.64 84.77,20 SJ1.1 | 85.41,20.64 85.41,17.78 88.27,14.92 91.12,14.92 92.71,13.33 92.71,10.16 91.12,8.57 US3_SONAR.4
SRVO1_PWR
  Bottom 0.406: 74.61,87.31 74.3,87.31 72.39,85.41 IC4.3
  Bottom 1.676: IC4.3 72.39,86.36
  Bottom 1.778: 72.39,86.36 78.11,92.08 82.55,92.08 R7.1 83.5,93.03 SRVO1.2
SRVO2_PWR
  Bottom 0.406: 56.2,78.42 55.88,78.74 | 53.98,78.11 IC3.3
  Bottom 0.61: R5.2 60.96,77.79 59.37,79.38
  Bottom 1.676: IC3.3 55.88,78.74 58.74,78.74 59.37,79.38
  Bottom 1.778: SRVO2.2 91.44,93.03 90.49,93.98 90.49,97.47 89.53,98.42 78.42,98.42 59.37,79.38
VCC
  Bottom 0.61: IC2.IN 30.48,73.66 C2.1
  Bottom 1.016: IC2.IN 30.48,84.45 28.57,86.36
  Bottom 1.676: SJ3.1 17.78,85.73 | 17.78,85.73 SJ3.2 | J1.PWR 16.83,86.21 | 16.83,86.21 17.29,86.21 17.78,85.73 | 16.83,86.21 16.98,86.36 28.57,86.36 46.04,86.36 48.26,84.14 IC3.1 48.26,72.71 49.85,71.12 64.14,71.12 67.31,74.3 IC4.1

### Text on the board
Bottom: proVANT / board.v3